# EAGLE design board (EAGLE 6.4)
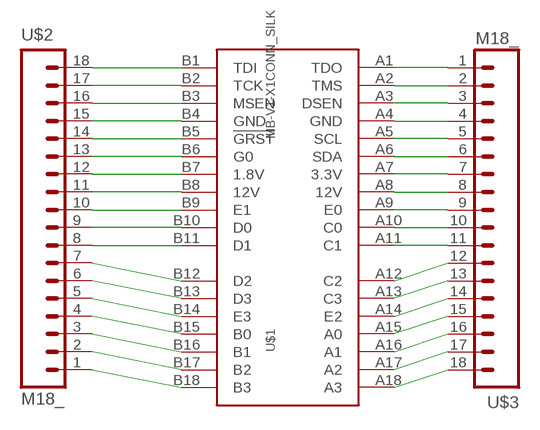
[diagram p0: schematic, sheet 1]

## Parts
U$1  MB-V1-X1CONN_SILK  [MB-V1-X1-CONN]
U$2  M18_  [1X18]
U$3  M18_  [1X18]

## Nets
1.8V: U$1.B7(1.8V) U$2.12
3.3V: U$1.A7(3.3V) U$3.7
12V: U$1.A8(12V) U$1.B8(12V) U$2.11 U$3.8
!GRST: U$1.B5(!GRST) U$2.14
A0: U$1.A15(A0) U$3.15
A1: U$1.A16(A1) U$3.16
A2: U$1.A17(A2) U$3.17
A3: U$1.A18(A3) U$3.18
B0: U$1.B15(B0) U$2.4
B1: U$1.B16(B1) U$2.3
B2: U$1.B17(B2) U$2.2
B3: U$1.B18(B3) U$2.1
C0: U$1.A10(C0) U$3.10
C1: U$1.A11(C1) U$3.11
C2: U$1.A12(C2) U$3.12
C3: U$1.A13(C3) U$3.13
D0: U$1.B10(D0) U$2.9
D1: U$1.B11(D1) U$2.8
D2: U$1.B12(D2) U$2.7
D3: U$1.B13(D3) U$2.6
DSEN: U$1.A3(DSEN) U$3.3
E0: U$1.A9(E0) U$3.9
E1: U$1.B9(E1) U$2.10
E2: U$1.A14(E2) U$3.14
E3: U$1.B14(E3) U$2.5
G0: U$1.B6(G0) U$2.13
GND: U$1.A4(GND) U$1.B4(GND) U$2.15 U$3.4
MSEN: U$1.B3(MSEN) U$2.16
SCL: U$1.A5(SCL) U$3.5
SDA: U$1.A6(SDA) U$3.6
TCK: U$1.B2(TCK) U$2.17
TD0: U$1.A1(TDO) U$3.1
TDI: U$1.B1(TDI) U$2.18
TMS: U$1.A2(TMS) U$3.2

## Library data of the parts
U$1 = kmod-connectors:MB-V1-X1
U$2 U$3 = SparkFun-Connectors:M18: 1x18 .1" header

## Net classes
0 default: width 0.381 mm

## Board
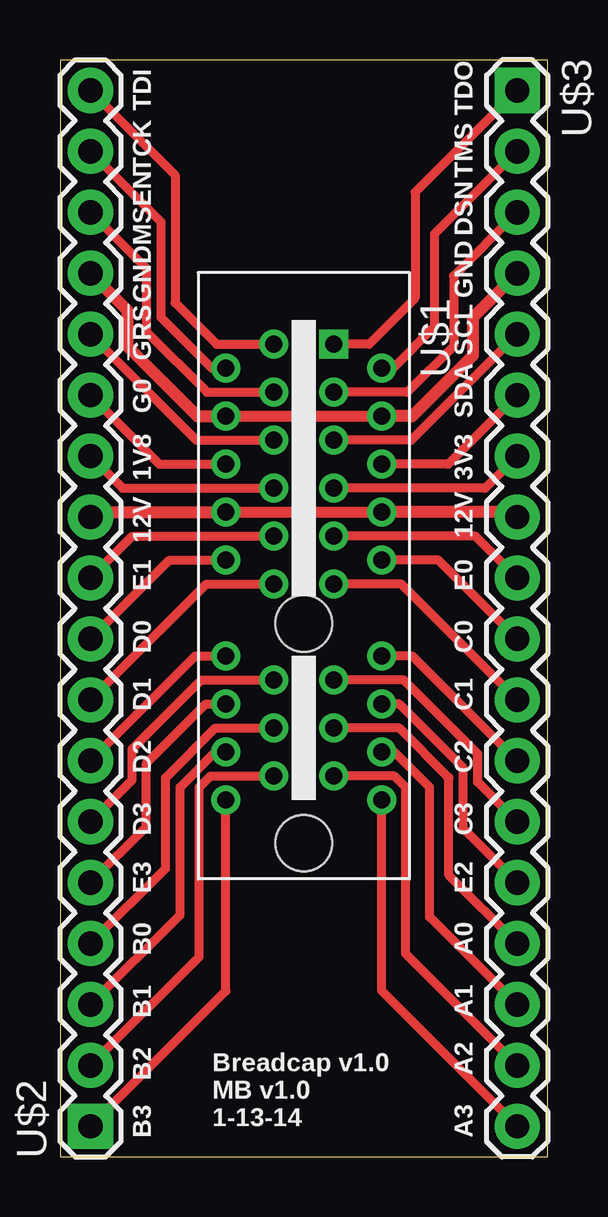
[diagram p1: board, top side]
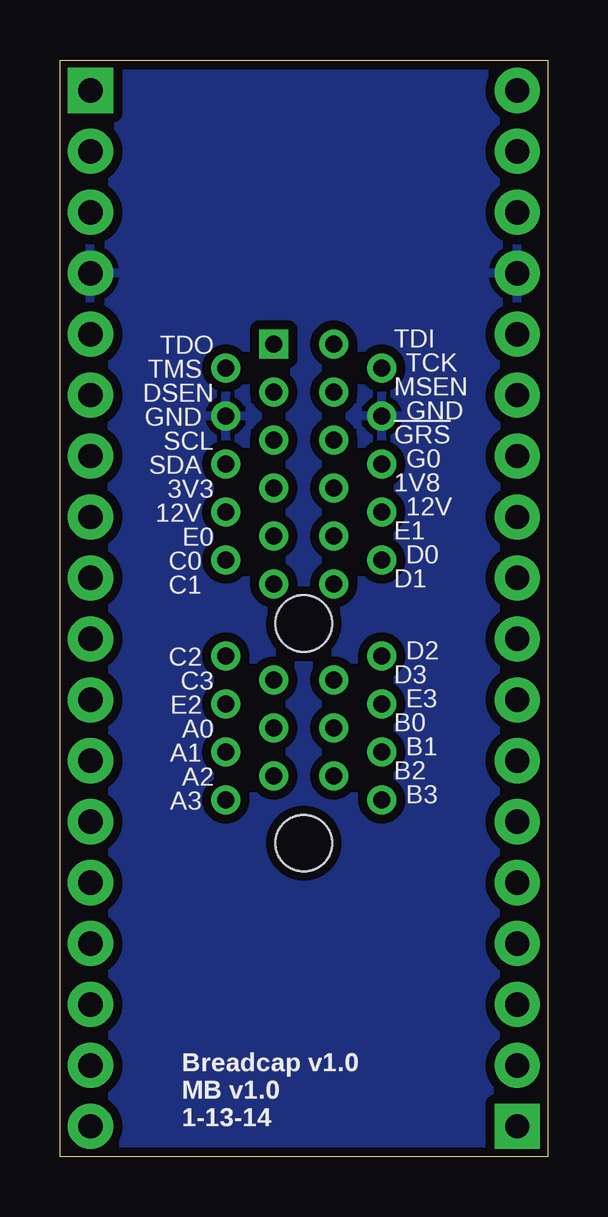
[diagram p2: board, bottom side, seen from below]

Size 20.32 x 45.72 mm. Coordinates in mm from the lower left corner, seen from the top.
Outline: 0,0 20.32,0 20.32,45.72 0,45.72 0,0
Copper layers (1*16): Top 0.0356mm / dielectric 1.5011mm / Bottom 0.0356mm
Design rules "OSHPark_mine": minimum track width 6mil, minimum drill 13mil, track to track 6mil, track to pad 6mil, pad to pad 6mil, via to via 6mil, smd to smd 6mil, copper to edge 15mil, drill to drill 6mil, minimum pad ring 7mil, minimum via ring 7mil, stop-mask expansion 2mil, vias tented up to drill 13mil, thermal gap 10mil

### Footprints (pad centres in the part's own frame; a part is rotated, then mirrored left to right if it is on the bottom)
MB-V1-X1-CONN = drill 0.7 pad 1.2 square: A1 -11.65,1.25 | drill 0.7 pad 1.2: A2 -10.65,3.25; A3 -9.65,1.25; A4 -8.65,3.25; A5 -7.65,1.25; A6 -6.65,3.25; A7 -5.65,1.25; A8 -4.65,3.25; A9 -3.65,1.25; A10 -2.65,3.25; A11 -1.65,1.25; A12 1.35,3.25; A13 2.35,1.25; A14 3.35,3.25; A15 4.35,1.25; A16 5.35,3.25; A17 6.35,1.25; A18 7.35,3.25; B1 -11.65,-1.25; B2 -10.65,-3.25; B3 -9.65,-1.25; B4 -8.65,-3.25; B5 -7.65,-1.25; B6 -6.65,-3.25; B7 -5.65,-1.25; B8 -4.65,-3.25; B9 -3.65,-1.25; B10 -2.65,-3.25; B11 -1.65,-1.25; B12 1.35,-3.25; B13 2.35,-1.25; B14 3.35,-3.25; B15 4.35,-1.25; B16 5.35,-3.25; B17 6.35,-1.25; B18 7.35,-3.25 | hole 2.35: 0,0; 9.15,0
1X18 = drill 1.016 pad 1.88 square: 1 0,0 | drill 1.016 pad 1.88: 2 2.54,0; 3 5.08,0; 4 7.62,0; 5 10.16,0; 6 12.7,0; 7 15.24,0; 8 17.78,0; 9 20.32,0; 10 22.86,0; 11 25.4,0; 12 27.94,0; 13 30.48,0; 14 33.02,0; 15 35.56,0; 16 38.1,0; 17 40.64,0; 18 43.18,0

### Placement (x,y rotation side)
U$1  10.16,22.23 270 top
U$2  1.27,1.27 90 top
U$3  19.05,44.45 270 top

### Tracks (layer width: path | path; a pad name or v marks a point on that pad's centre or on a via)
1.8V
  Top 0.381: U$2.12 2.6,27.88 U$1.B7
3.3V
  Top 0.381: U$3.7 17.71,27.88 U$1.A7
12V
  Top 0.381: U$2.11 1.48,26.88 | U$3.8 18.84,26.88
  Top 0.457: U$1.B8 U$1.A8
  Top 0.508: 1.48,26.88 U$1.B8 | 18.84,26.88 U$1.A8
!GRST
  Top 0.381: U$2.14 5.68,29.88 U$1.B5
A0
  Top 0.381: U$3.15 16.2,11.74 16.2,15.8 14.12,17.88 U$1.A15
A1
  Top 0.381: U$3.16 15.4,10 15.4,15.4 13.93,16.88 U$1.A16
A2
  Top 0.381: U$3.17 14.4,8.46 14.4,15.4 13.93,15.88 U$1.A17
A3
  Top 0.381: U$3.18 13.41,6.91 U$1.A18
B0
  Top 0.381: U$2.4 4.4,12.02 4.4,15.8 6.47,17.88 U$1.B15
B1
  Top 0.381: U$2.3 5,10.08 5,15.4 6.47,16.88 U$1.B16
B2
  Top 0.381: U$2.2 5.8,8.34 5.8,15.4 6.28,15.88 U$1.B17
B3
  Top 0.381: U$2.1 6.91,6.91 U$1.B18
C0
  Top 0.381: U$3.10 15.77,24.88 U$1.A10
C1
  Top 0.381: U$3.11 14.22,23.88 U$1.A11
C2
  Top 0.381: U$3.12 14.69,20.88 U$1.A12
C3
  Top 0.381: U$3.13 17.4,15.62 17.4,16.8 14.32,19.88 U$1.A13
D0
  Top 0.381: U$2.9 4.55,24.88 U$1.B10
D1
  Top 0.381: U$2.8 6.09,23.88 U$1.B11
D2
  Top 0.381: U$2.7 5.63,20.88 U$1.B12
D3
  Top 0.381: U$2.6 3,15.7 3,17 5.88,19.88 U$1.B13
DSEN
  Top 0.381: U$3.3 16.4,36.72 16.4,33.8 14.47,31.88 U$1.A3
E0
  Top 0.381: U$3.9 17.3,25.88 U$1.A9
E1
  Top 0.381: U$2.10 3.02,25.88 U$1.B9
E2
  Top 0.381: U$3.14 16.8,13.68 16.8,16.2 14.12,18.88 U$1.A14
E3
  Top 0.381: U$2.5 3.6,13.76 3.6,16.4 6.08,18.88 U$1.B14
G0
  Top 0.381: U$2.13 4.14,28.88 U$1.B6
GND
  Top 0.457: U$1.B4 U$1.A4
  Top 0.508: U$2.15 2.8,35.3 2.8,33.8 5.72,30.88 U$1.B4 | U$3.4 17.2,34.98 17.2,33.4 14.68,30.88 U$1.A4
  pour Bottom (isolate 0.381): 0,45.72 20.32,45.72 20.32,0 0,0
MSEN
  Top 0.381: U$2.16 3.6,37.04 3.6,34.4 6.12,31.88 U$1.B3
SCL
  Top 0.381: U$3.5 14.63,29.88 U$1.A5
SDA
  Top 0.381: U$3.6 16.18,28.88 U$1.A6
TCK
  Top 0.381: U$2.17 4.2,38.98 4.2,35 6.33,32.88 U$1.B2
TD0
  Top 0.381: U$3.1 14.8,40.2 14.8,35.8 12.88,33.88 U$1.A1
TDI
  Top 0.381: U$2.18 4.8,40.92 4.8,35.6 6.53,33.88 U$1.B1
TMS
  Top 0.381: U$3.2 15.6,38.46 15.6,34.6 13.88,32.88 U$1.A2

### Text on the board
tPlace: TDI | TDO | TCK | TMS | MSEN | DSN | GND | GND | !GRS | SCL | G0 | SDA | 1V8 | 3V3 | 12V | 12V | E1 | E0 | D0 | C0 | D1 | C1 | D2 | C2 | D3 | C3 | E3 | E2 | B0 | A0 | B1 | A1 | B2 | A2 | B3 | Breadcap v1.0 / MB v1.0 / 1-13-14 | A3
bPlace: Breadcap v1.0 / MB v1.0 / 1-13-14